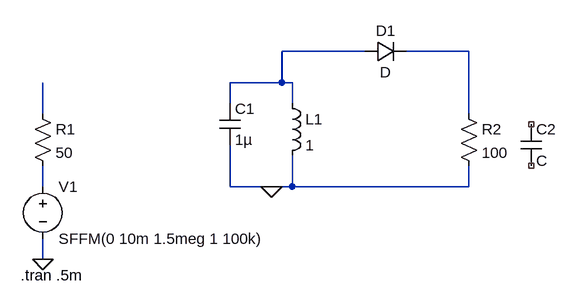
[diagram p0: schematic slope-detector.asc]
slope-detector.asc, the LTspice schematic file:
Version 4
SHEET 1 880 680
WIRE 320 48 192 48
WIRE 480 48 384 48
WIRE 192 96 192 48
WIRE 192 96 112 96
WIRE 208 96 192 96
WIRE 112 128 112 96
WIRE 208 128 208 96
WIRE -176 144 -176 96
WIRE 480 144 480 48
WIRE -176 256 -176 224
WIRE 112 256 112 192
WIRE 176 256 112 256
WIRE 208 256 208 208
WIRE 208 256 176 256
WIRE 480 256 480 224
WIRE 480 256 208 256
WIRE -176 368 -176 336
FLAG -176 368 0
FLAG 176 256 0
SYMBOL cap 96 128 R0
SYMATTR InstName C1
SYMATTR Value 1µ
SYMBOL ind 192 112 R0
SYMATTR InstName L1
SYMATTR Value 1
SYMBOL diode 320 64 R270
WINDOW 0 32 32 VTop 2
WINDOW 3 0 32 VBottom 2
SYMATTR InstName D1
SYMBOL voltage -176 240 R0
WINDOW 123 0 0 Left 0
WINDOW 39 0 0 Left 0
SYMATTR InstName V1
SYMATTR Value SFFM(0 10m 1.5meg 1 100k)
SYMBOL res -192 128 R0
SYMATTR InstName R1
SYMATTR Value 50
SYMBOL res 464 128 R0
SYMATTR InstName R2
SYMATTR Value 100
SYMBOL cap 560 160 R0
SYMATTR InstName C2
TEXT -210 392 Left 2 !.tran .5m

The netlist it stands for:
* slope-detector.asc
C1 N001 0 1µ
L1 N001 0 1
D1 N001 N002 D
V1 N004 0 SFFM(0 10m 1.5meg 1 100k)
R1 N003 N004 50
R2 N002 0 100
C2 NC_01 NC_02 C
.model D D
.lib standard.dio
.tran .5m
.backanno
.end